# Altium schematic sheet top.SchDoc: Triumvi - MCU - Top
size Letter; Author: Ye-Sheng Kuo; Organization: Altium Limited; Address1: L3, 12a Rodborough Rd; Address2: Frenchs Forest; Address3: NSW; Address4: Australia 2086; Revision: 10; SheetNumber: 1; SheetTotal: 5
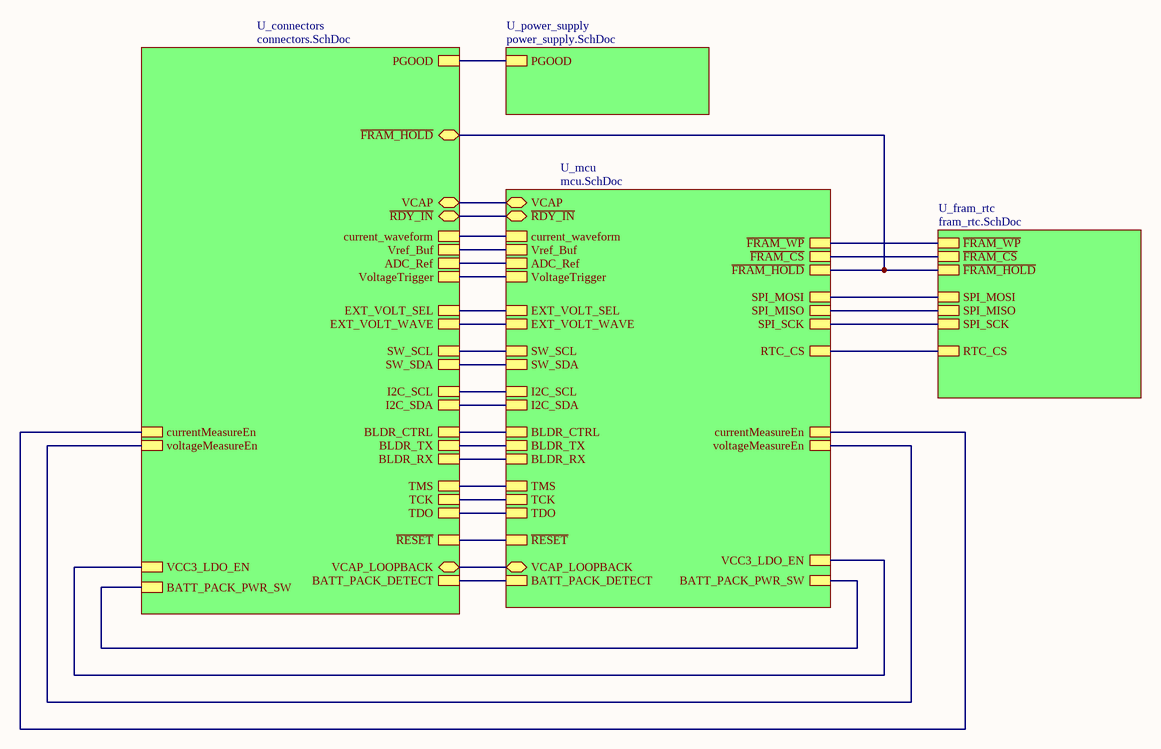
[diagram p0: top.SchDoc]

## Sub-sheets
U_connectors = connectors.SchDoc: I2C_SCL, I2C_SDA, EXT_VOLT_SEL, ~{RESET}, TMS, TCK, TDO, BLDR_CTRL, BLDR_TX, BLDR_RX, SW_SCL, SW_SDA, current_waveform, Vref_Buf, VoltageTrigger, VCC3_LDO_EN, voltageMeasureEn, currentMeasureEn, ADC_Ref, EXT_VOLT_WAVE, PGOOD, BATT_PACK_DETECT, BATT_PACK_PWR_SW, VCAP_LOOPBACK, VCAP, ~{RDY_IN}, ~{FRAM_HOLD}
U_fram_rtc = fram_rtc.SchDoc: ~{FRAM_WP}, ~{FRAM_CS}, ~{FRAM_HOLD}, SPI_MOSI, SPI_SCK, SPI_MISO, RTC_CS
U_mcu = mcu.SchDoc: current_waveform, Vref_Buf, voltageMeasureEn, currentMeasureEn, VoltageTrigger, ~{FRAM_WP}, ~{FRAM_CS}, ~{FRAM_HOLD}, SPI_SCK, SPI_MOSI, SPI_MISO, RTC_CS, I2C_SCL, I2C_SDA, EXT_VOLT_SEL, EXT_VOLT_WAVE, TDO, BLDR_CTRL, BLDR_TX, BLDR_RX, ~{RESET}, TMS, TCK, VCC3_LDO_EN, ADC_Ref, SW_SCL, SW_SDA, BATT_PACK_DETECT, BATT_PACK_PWR_SW, VCAP_LOOPBACK, VCAP, ~{RDY_IN}
U_power_supply = power_supply.SchDoc: PGOOD

## Nets
(unnamed): sheet U_connectors/I2C_SCL, sheet U_mcu/I2C_SCL
(unnamed): sheet U_connectors/I2C_SDA, sheet U_mcu/I2C_SDA
(unnamed): sheet U_connectors/EXT_VOLT_SEL, sheet U_mcu/EXT_VOLT_SEL
(unnamed): sheet U_connectors/~{RESET}, sheet U_mcu/~{RESET}
(unnamed): sheet U_connectors/TMS, sheet U_mcu/TMS
(unnamed): sheet U_connectors/TCK, sheet U_mcu/TCK
(unnamed): sheet U_connectors/TDO, sheet U_mcu/TDO
(unnamed): sheet U_connectors/BLDR_CTRL, sheet U_mcu/BLDR_CTRL
(unnamed): sheet U_connectors/BLDR_TX, sheet U_mcu/BLDR_TX
(unnamed): sheet U_connectors/BLDR_RX, sheet U_mcu/BLDR_RX
(unnamed): sheet U_connectors/SW_SCL, sheet U_mcu/SW_SCL
(unnamed): sheet U_connectors/SW_SDA, sheet U_mcu/SW_SDA
(unnamed): sheet U_connectors/current_waveform, sheet U_mcu/current_waveform
(unnamed): sheet U_connectors/Vref_Buf, sheet U_mcu/Vref_Buf
(unnamed): sheet U_connectors/VoltageTrigger, sheet U_mcu/VoltageTrigger
(unnamed): sheet U_connectors/VCC3_LDO_EN, sheet U_mcu/VCC3_LDO_EN
(unnamed): sheet U_connectors/voltageMeasureEn, sheet U_mcu/voltageMeasureEn
(unnamed): sheet U_connectors/currentMeasureEn, sheet U_mcu/currentMeasureEn
(unnamed): sheet U_connectors/ADC_Ref, sheet U_mcu/ADC_Ref
(unnamed): sheet U_connectors/EXT_VOLT_WAVE, sheet U_mcu/EXT_VOLT_WAVE
(unnamed): sheet U_connectors/PGOOD, sheet U_power_supply/PGOOD
(unnamed): sheet U_connectors/BATT_PACK_DETECT, sheet U_mcu/BATT_PACK_DETECT
(unnamed): sheet U_connectors/BATT_PACK_PWR_SW, sheet U_mcu/BATT_PACK_PWR_SW
(unnamed): sheet U_connectors/VCAP_LOOPBACK, sheet U_mcu/VCAP_LOOPBACK
(unnamed): sheet U_connectors/VCAP, sheet U_mcu/VCAP
(unnamed): sheet U_connectors/~{RDY_IN}, sheet U_mcu/~{RDY_IN}
(unnamed): sheet U_connectors/~{FRAM_HOLD}, sheet U_fram_rtc/~{FRAM_HOLD}, sheet U_mcu/~{FRAM_HOLD}
(unnamed): sheet U_fram_rtc/~{FRAM_WP}, sheet U_mcu/~{FRAM_WP}
(unnamed): sheet U_fram_rtc/~{FRAM_CS}, sheet U_mcu/~{FRAM_CS}
(unnamed): sheet U_fram_rtc/SPI_MOSI, sheet U_mcu/SPI_MOSI
(unnamed): sheet U_fram_rtc/SPI_SCK, sheet U_mcu/SPI_SCK
(unnamed): sheet U_fram_rtc/SPI_MISO, sheet U_mcu/SPI_MISO
(unnamed): sheet U_fram_rtc/RTC_CS, sheet U_mcu/RTC_CS

## Notes on the sheet
- Title
- Date:
- Author:
- Revision:
- Sheet
- of
- University of Michigan
- File: